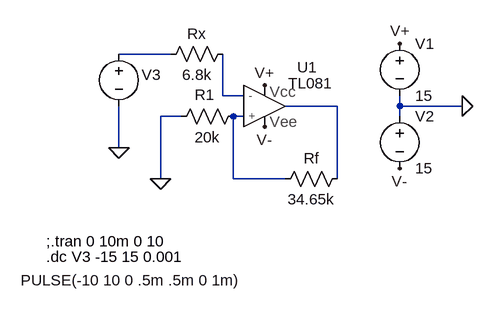
[diagram p0: schematic Biestable - schmitt trigger - INV.asc]
Biestable - schmitt trigger - INV.asc, the LTspice schematic file:
Version 4
SHEET 1 880 680
WIRE 64 16 -16 16
WIRE 144 80 144 16
WIRE 176 80 144 80
WIRE 320 96 240 96
WIRE 416 96 416 80
WIRE 512 96 416 96
WIRE 80 112 48 112
WIRE 176 112 160 112
WIRE 416 112 416 96
WIRE -16 160 -16 96
WIRE 48 208 48 112
WIRE 160 208 160 112
WIRE 240 208 160 208
WIRE 320 208 320 96
FLAG 208 128 V-
FLAG 512 96 0
FLAG 416 0 V+
FLAG 416 192 V-
FLAG 208 64 V+
FLAG -16 160 0
FLAG 48 208 0
SYMBOL Agregados\\TL081 208 96 R0
SYMATTR InstName U1
SYMBOL voltage 416 -16 R0
WINDOW 123 0 0 Left 0
WINDOW 39 0 0 Left 0
SYMATTR InstName V1
SYMATTR Value 15
SYMBOL voltage 416 96 R0
WINDOW 123 0 0 Left 0
WINDOW 39 0 0 Left 0
SYMATTR InstName V2
SYMATTR Value 15
SYMBOL res 176 96 R90
WINDOW 0 -2 60 VBottom 2
WINDOW 3 32 56 VTop 2
SYMATTR InstName R1
SYMATTR Value 20k
SYMBOL res 336 192 R90
WINDOW 0 0 56 VBottom 2
WINDOW 3 32 56 VTop 2
SYMATTR InstName Rf
SYMATTR Value 34.65k
SYMBOL voltage -16 0 R0
WINDOW 123 0 0 Left 0
WINDOW 39 0 0 Left 0
WINDOW 3 -151 364 Left 2
WINDOW 0 35 48 Left 2
SYMATTR Value PULSE(-10 10 0 .5m .5m 0 1m)
SYMATTR InstName V3
SYMBOL res 160 0 R90
WINDOW 0 0 56 VBottom 2
WINDOW 3 32 56 VTop 2
SYMATTR InstName Rx
SYMATTR Value 6.8k
TEXT -128 304 Left 2 !;.tran 0 10m 0 10
TEXT -128 328 Left 2 !.dc V3 -15 15 0.001

The netlist it stands for:
* Biestable - schmitt trigger - INV.asc
XU1 N004 N002 V+ V- N003 TL081  ; pins + - ? ? ?
V1 V+ 0 15
V2 0 V- 15
R1 N004 0 20k
Rf N003 N004 34.65k
V3 N001 0 PULSE(-10 10 0 .5m .5m 0 1m)
Rx N002 N001 6.8k
;.tran 0 10m 0 10
.dc V3 -15 15 0.001
.lib E:\Descargas\TL081.net
.backanno
.end